# Altium project uC_Board.PrjPcb
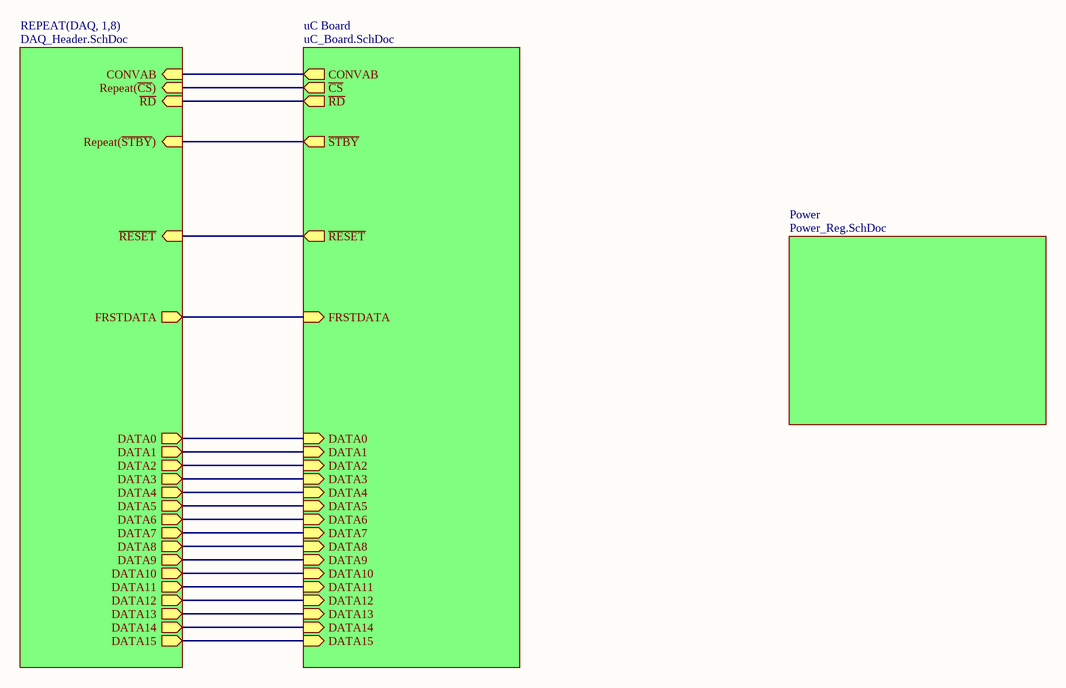
[diagram p0: High_Level_uC_Board.SchDoc]
4 sheets, 75 parts. Net scope: hierarchical (ports join the sheet entries above them; power ports are global).
Board file: FC_MainBoard.PcbDoc
Sheets:
  High_Level_uC_Board.SchDoc
    uC Board = uC_Board.SchDoc
    Power = Power_Reg.SchDoc
    DAQ1 = DAQ_Header.SchDoc
    DAQ2 = DAQ_Header.SchDoc
    DAQ3 = DAQ_Header.SchDoc
    DAQ4 = DAQ_Header.SchDoc
    DAQ5 = DAQ_Header.SchDoc
    DAQ6 = DAQ_Header.SchDoc
    DAQ7 = DAQ_Header.SchDoc
    DAQ8 = DAQ_Header.SchDoc

## Sheet High_Level_uC_Board.SchDoc
size A

### Sub-sheets
Power = Power_Reg.SchDoc: no entries
REPEAT(DAQ, 1,8) = DAQ_Header.SchDoc: CONVAB (in), Repeat(~{CS}) (in), ~{RD} (in), Repeat(~{STBY}) (in), ~{RESET} (in), FRSTDATA (out), DATA0 (out), DATA1 (out), DATA2 (out), DATA3 (out), DATA4 (out), DATA5 (out), DATA6 (out), DATA7 (out), DATA8 (out), DATA9 (out), DATA10 (out), DATA11 (out), DATA12 (out), DATA13 (out), DATA14 (out), DATA15 (out)
uC Board = uC_Board.SchDoc: CONVAB (out), ~{CS} (out), ~{RD} (out), ~{STBY} (out), ~{RESET} (out), FRSTDATA (in), DATA0 (in), DATA1 (in), DATA2 (in), DATA3 (in), DATA4 (in), DATA5 (in), DATA6 (in), DATA7 (in), DATA8 (in), DATA9 (in), DATA10 (in), DATA11 (in), DATA12 (in), DATA13 (in), DATA14 (in), DATA15 (in)

### Nets
~{CS}_DAQ[1..8]: sheet uC Board/~{CS}, sheet REPEAT(DAQ, 1,8)/Repeat(~{CS})
CONVAB: sheet uC Board/CONVAB, sheet REPEAT(DAQ, 1,8)/CONVAB
DATA0: sheet uC Board/DATA0, sheet REPEAT(DAQ, 1,8)/DATA0
DATA1: sheet uC Board/DATA1, sheet REPEAT(DAQ, 1,8)/DATA1
DATA2: sheet uC Board/DATA2, sheet REPEAT(DAQ, 1,8)/DATA2
DATA3: sheet uC Board/DATA3, sheet REPEAT(DAQ, 1,8)/DATA3
DATA4: sheet uC Board/DATA4, sheet REPEAT(DAQ, 1,8)/DATA4
DATA5: sheet uC Board/DATA5, sheet REPEAT(DAQ, 1,8)/DATA5
DATA6: sheet uC Board/DATA6, sheet REPEAT(DAQ, 1,8)/DATA6
DATA7: sheet uC Board/DATA7, sheet REPEAT(DAQ, 1,8)/DATA7
DATA8: sheet uC Board/DATA8, sheet REPEAT(DAQ, 1,8)/DATA8
DATA9: sheet uC Board/DATA9, sheet REPEAT(DAQ, 1,8)/DATA9
DATA10: sheet uC Board/DATA10, sheet REPEAT(DAQ, 1,8)/DATA10
DATA11: sheet uC Board/DATA11, sheet REPEAT(DAQ, 1,8)/DATA11
DATA12: sheet uC Board/DATA12, sheet REPEAT(DAQ, 1,8)/DATA12
DATA13: sheet uC Board/DATA13, sheet REPEAT(DAQ, 1,8)/DATA13
DATA14: sheet uC Board/DATA14, sheet REPEAT(DAQ, 1,8)/DATA14
DATA15: sheet uC Board/DATA15, sheet REPEAT(DAQ, 1,8)/DATA15
FRSTDATA: sheet uC Board/FRSTDATA, sheet REPEAT(DAQ, 1,8)/FRSTDATA
~{RD}: sheet uC Board/~{RD}, sheet REPEAT(DAQ, 1,8)/~{RD}
~{RESET}: sheet uC Board/~{RESET}, sheet REPEAT(DAQ, 1,8)/~{RESET}
(unnamed): sheet uC Board/~{STBY}, sheet REPEAT(DAQ, 1,8)/Repeat(~{STBY})

## Sheet uC_Board.SchDoc
size Legal
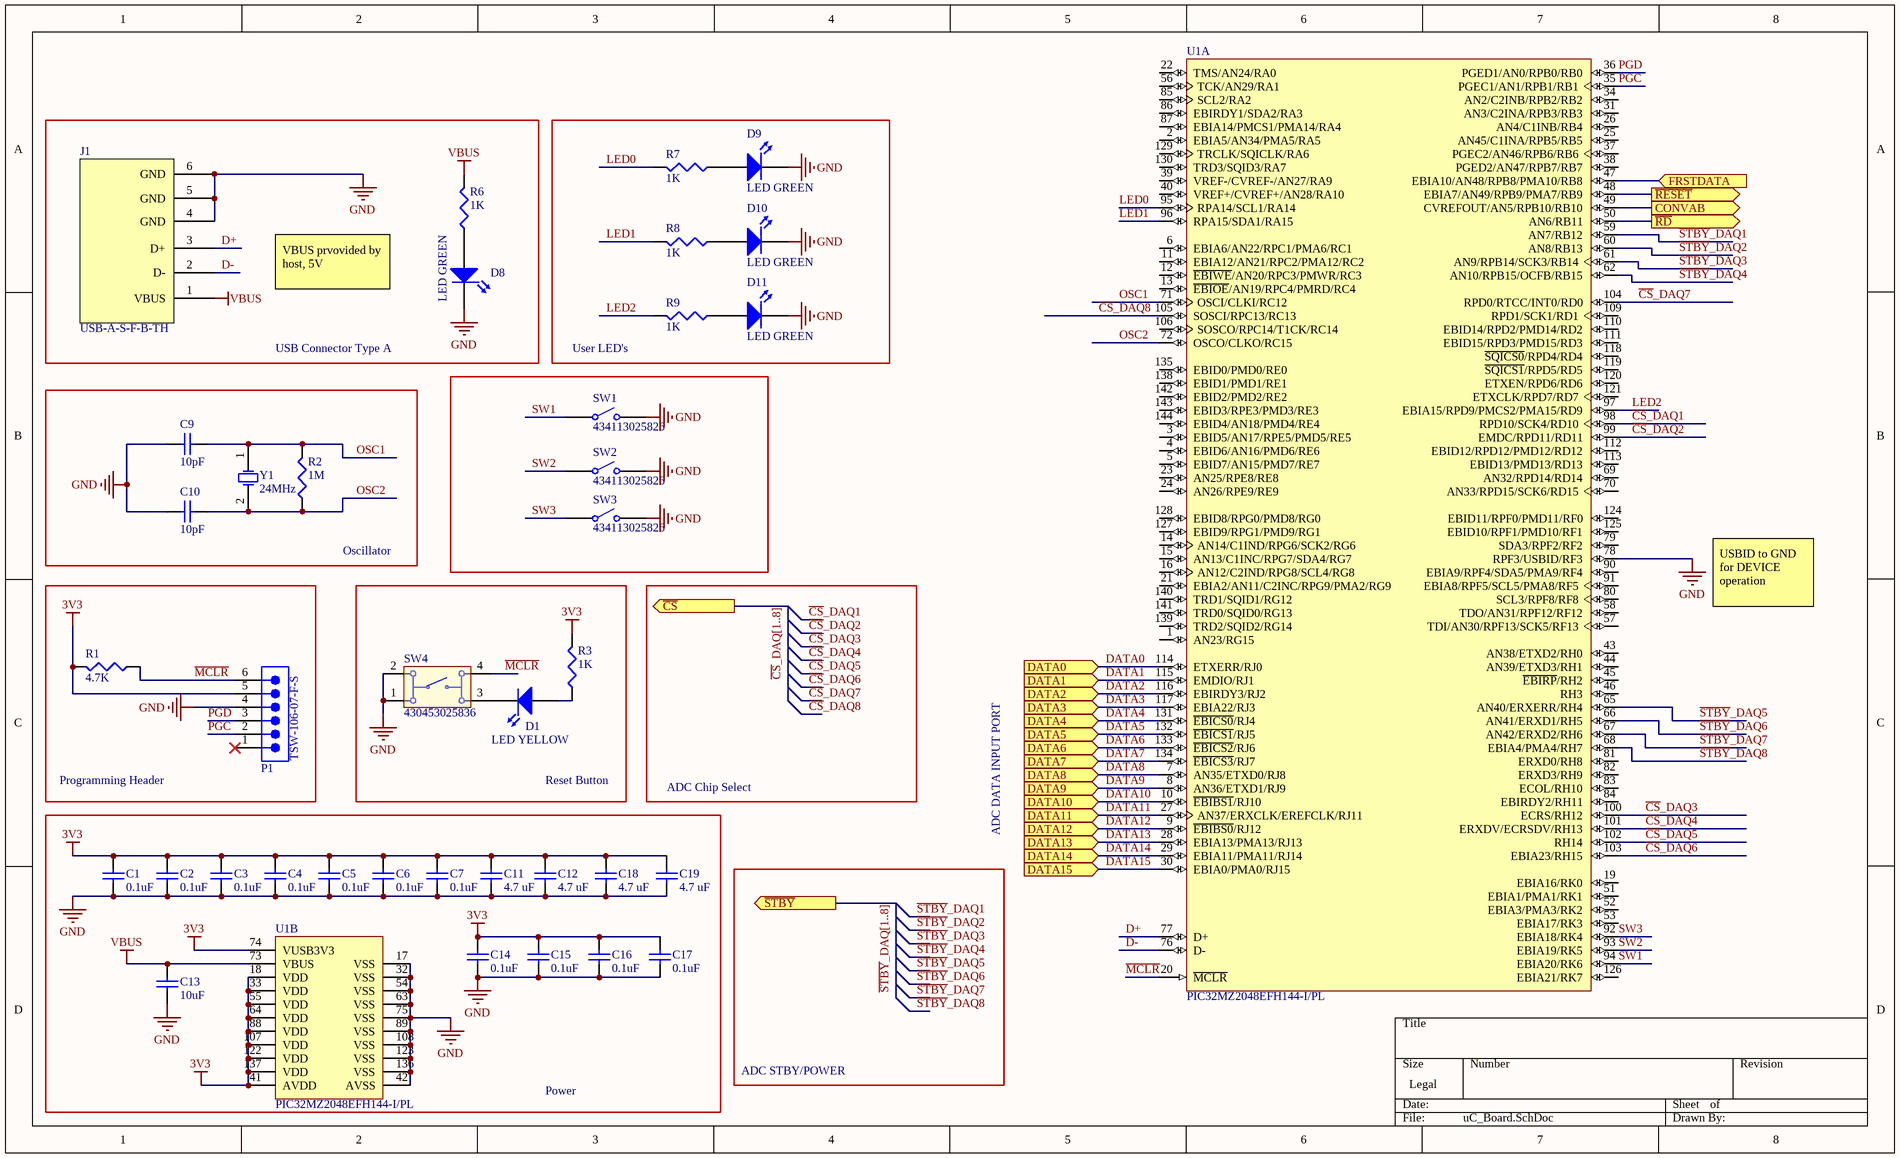
[diagram p1: uC_Board.SchDoc]

### Parts
C1  value 0.1uF  [0402]  (hidden comment: C0402)
C2  value 0.1uF  [0402]  (hidden comment: C0402)
C3  value 0.1uF  [0402]  (hidden comment: C0402)
C4  value 0.1uF  [0402]  (hidden comment: C0402)
C5  value 0.1uF  [0402]  (hidden comment: C0402)
C6  value 0.1uF  [0402]  (hidden comment: C0402)
C7  value 0.1uF  [0402]  (hidden comment: C0402)
C9  value 10pF  [0805]  (hidden comment: C0805)
C10  value 10pF  [0805]  (hidden comment: C0805)
C11  value 4.7 uF  [0603]  (hidden comment: C0603)
C12  value 4.7 uF  [0603]  (hidden comment: C0603)
C13  value 10uF  [0805]  (hidden comment: C0805)
C14  value 0.1uF  [0402]  (hidden comment: C0402)
C15  value 0.1uF  [0402]  (hidden comment: C0402)
C16  value 0.1uF  [0402]  (hidden comment: C0402)
C17  value 0.1uF  [0402]  (hidden comment: C0402)
C18  value 4.7 uF  [0603]  (hidden comment: C0603)
C19  value 4.7 uF  [0603]  (hidden comment: C0603)
D1  LED YELLOW  [C0805]
D8  LED GREEN  [C0805]
D9  LED GREEN  [C0805]
D10  LED GREEN  [C0805]
D11  LED GREEN  [C0805]
J1  USB-A-S-F-B-TH  [USB-A Connector]
P1  TSW-106-07-F-S  [SMTC-TSW-106-07-X-S]
R1  value 4.7K  [J1-0603]  (hidden comment: Res3)
R2  value 1M  [0402]  (hidden comment: Res3)
R3  value 1K  [0402]  (hidden comment: Res3)
R6  value 1K  [0402]  (hidden comment: Res3)
R7  value 1K  [0402]  (hidden comment: Res3)
R8  value 1K  [0402]  (hidden comment: Res3)
R9  value 1K  [0402]  (hidden comment: Res3)
SW1  434113025826  [434113025826]
SW2  434113025826  [434113025826]
SW3  434113025826  [434113025826]
SW4  430453025836  [430453025836]
U1  PIC32MZ2048EFH144-I/PL  [MCHP-LQFP-PL144_N]  (parts A,B of 2)
Y1  24MHz  [HC49US]

### Blocks framed on the sheet
USB Connector Type A: D8 J1 R6
User LED's: D9-D11 R7-R9
Oscillator: C9 C10 R2 Y1
Programming Header: P1 R1
Reset Button: D1 R3 SW4
Power: C1-C7 C11-C19 U1

### Ports
CONVAB (out), DATA0 (in), DATA1 (in), DATA2 (in), DATA3 (in), DATA4 (in), DATA5 (in), DATA6 (in), DATA7 (in), DATA8 (in), DATA9 (in), DATA10 (in), DATA11 (in), DATA12 (in), DATA13 (in), DATA14 (in), DATA15 (in), FRSTDATA (in), ~{CS} (out), ~{RD} (out), ~{RESET} (out), ~{STBY} (out)

### Nets
3V3: C1.2 C2.2 C3.2 C4.2 C5.2 C6.2 C7.2 C11.1 C12.1 C14.2 C15.2 C16.2 C17.2 C18.1 C19.1 P1.5 R1.2 R3.2 U1.18(VDD) U1.33(VDD) U1.41(AVDD) U1.55(VDD) U1.64(VDD) U1.74(VUSB3V3) U1.88(VDD) U1.107(VDD) U1.122(VDD) U1.137(VDD)
GND: C1.1 C2.1 C3.1 C4.1 C5.1 C6.1 C7.1 C9.1 C10.1 C11.2 C12.2 C13.1 C14.1 C15.1 C16.1 C17.1 C18.2 C19.2 D8.2(K) D9.2(K) D10.2(K) D11.2(K) J1.4(GND) J1.5(GND) J1.6(GND) P1.4 SW1.2 SW2.2 SW3.2 SW4.1 SW4.2 U1.17(VSS) U1.32(VSS) U1.42(AVSS) U1.54(VSS) U1.63(VSS) U1.75(VSS) U1.78(RPF3/USBID/RF3) U1.89(VSS) U1.108(VSS) U1.123(VSS) U1.136(VSS)
VBUS: C13.2 J1.1(VBUS) R6.2 U1.73(VBUS)
~{CS}_DAQ1: U1.98(RPD10/SCK4/RD10)
~{CS}_DAQ2: U1.99(EMDC/RPD11/RD11)
~{CS}_DAQ3: U1.100(ECRS/RH12)
~{CS}_DAQ4: U1.101(ERXDV/ECRSDV/RH13)
~{CS}_DAQ5: U1.102(RH14)
~{CS}_DAQ6: U1.103(EBIA23/RH15)
~{CS}_DAQ7: U1.104(RPD0/RTCC/INT0/RD0)
~{CS}_DAQ8: U1.105(SOSCI/RPC13/RC13)
CONVAB: U1.49(CVREFOUT/AN5/RPB10/RB10) ; port CONVAB
D+: J1.3(D+) U1.77(D+)
D-: J1.2(D-) U1.76(D-)
DATA0: U1.114(ETXERR/RJ0) ; port DATA0
DATA1: U1.115(EMDIO/RJ1) ; port DATA1
DATA2: U1.116(EBIRDY3/RJ2) ; port DATA2
DATA3: U1.117(EBIA22/RJ3) ; port DATA3
DATA4: U1.131(~{EBICS0}/RJ4) ; port DATA4
DATA5: U1.132(~{EBICS1}/RJ5) ; port DATA5
DATA6: U1.133(~{EBICS2}/RJ6) ; port DATA6
DATA7: U1.134(~{EBICS3}/RJ7) ; port DATA7
DATA8: U1.7(AN35/ETXD0/RJ8) ; port DATA8
DATA9: U1.8(AN36/ETXD1/RJ9) ; port DATA9
DATA10: U1.10(~{EBIBS1}/RJ10) ; port DATA10
DATA11: U1.27(AN37/ERXCLK/EREFCLK/RJ11) ; port DATA11
DATA12: U1.9(~{EBIBS0}/RJ12) ; port DATA12
DATA13: U1.28(EBIA13/PMA13/RJ13) ; port DATA13
DATA14: U1.29(EBIA11/PMA11/RJ14) ; port DATA14
DATA15: U1.30(EBIA0/PMA0/RJ15) ; port DATA15
FRSTDATA: U1.47(EBIA10/AN48/RPB8/PMA10/RB8) ; port FRSTDATA
LED0: R7.2 U1.95(RPA14/SCL1/RA14)
LED1: R8.2 U1.96(RPA15/SDA1/RA15)
LED2: R9.2 U1.97(EBIA15/RPD9/PMCS2/PMA15/RD9)
~{MCLR}: P1.6 R1.1 SW4.4 U1.20(~{MCLR})
OSC1: C9.2 R2.2 U1.71(OSCI/CLKI/RC12) Y1.1(OSC1)
OSC2: C10.2 R2.1 U1.72(OSCO/CLKO/RC15) Y1.2(OSC2)
PGC: P1.2 U1.35(PGEC1/AN1/RPB1/RB1)
PGD: P1.3 U1.36(PGED1/AN0/RPB0/RB0)
~{RD}: U1.50(AN6/RB11) ; port ~{RD}
~{RESET}: U1.48(EBIA7/AN49/RPB9/PMA7/RB9) ; port ~{RESET}
~{STBY}_DAQ1: U1.59(AN7/RB12)
~{STBY}_DAQ2: U1.60(AN8/RB13)
~{STBY}_DAQ3: U1.61(AN9/RPB14/SCK3/RB14)
~{STBY}_DAQ4: U1.62(AN10/RPB15/OCFB/RB15)
~{STBY}_DAQ5: U1.65(AN40/ERXERR/RH4)
~{STBY}_DAQ6: U1.66(AN41/ERXD1/RH5)
~{STBY}_DAQ7: U1.67(AN42/ERXD2/RH6)
~{STBY}_DAQ8: U1.68(EBIA4/PMA4/RH7)
SW1: SW1.1 U1.94(EBIA20/RK6)
SW2: SW2.1 U1.93(EBIA19/RK5)
SW3: SW3.1 U1.92(EBIA18/RK4)
NetD1_1: D1.1(A) R3.1
NetD1_2: D1.2(K) SW4.3
NetD8_1: D8.1(A) R6.1
NetD9_1: D9.1(A) R7.1
NetD10_1: D10.1(A) R8.1
NetD11_1: D11.1(A) R9.1

Not connected (* = marked no-connect by the designer): P1 1*; U1 1(AN23/RG15) 2(EBIA5/AN34/PMA5/RA5) 3(EBID5/AN17/RPE5/PMD5/RE5) 4(EBID6/AN16/PMD6/RE6) 5(EBID7/AN15/PMD7/RE7) 6(EBIA6/AN22/RPC1/PMA6/RC1) 11(EBIA12/AN21/RPC2/PMA12/RC2) 12(~{EBIWE}/AN20/RPC3/PMWR/RC3) 13(~{EBIOE}/AN19/RPC4/PMRD/RC4) 14(AN14/C1IND/RPG6/SCK2/RG6) 15(AN13/C1INC/RPG7/SDA4/RG7) 16(AN12/C2IND/RPG8/SCL4/RG8) 19(EBIA16/RK0) 21(EBIA2/AN11/C2INC/RPG9/PMA2/RG9) 22(TMS/AN24/RA0) 23(AN25/RPE8/RE8) 24(AN26/RPE9/RE9) 25(AN45/C1INA/RPB5/RB5) 26(AN4/C1INB/RB4) 31(AN3/C2INA/RPB3/RB3) 34(AN2/C2INB/RPB2/RB2) 37(PGEC2/AN46/RPB6/RB6) 38(PGED2/AN47/RPB7/RB7) 39(VREF-/CVREF-/AN27/RA9) 40(VREF+/CVREF+/AN28/RA10) 43(AN38/ETXD2/RH0) 44(AN39/ETXD3/RH1) 45(~{EBIRP}/RH2) 46(RH3) 51(EBIA1/PMA1/RK1) 52(EBIA3/PMA3/RK2) 53(EBIA17/RK3) 56(TCK/AN29/RA1) 57(TDI/AN30/RPF13/SCK5/RF13) 58(TDO/AN31/RPF12/RF12) 69(AN32/RPD14/RD14) 70(AN33/RPD15/SCK6/RD15) 79(SDA3/RPF2/RF2) 80(SCL3/RPF8/RF8) 81(ERXD0/RH8) 82(ERXD3/RH9) 83(ECOL/RH10) 84(EBIRDY2/RH11) 85(SCL2/RA2) 86(EBIRDY1/SDA2/RA3) 87(EBIA14/PMCS1/PMA14/RA4) 90(EBIA9/RPF4/SDA5/PMA9/RF4) 91(EBIA8/RPF5/SCL5/PMA8/RF5) 106(SOSCO/RPC14/T1CK/RC14) 109(RPD1/SCK1/RD1) 110(EBID14/RPD2/PMD14/RD2) 111(EBID15/RPD3/PMD15/RD3) 112(EBID12/RPD12/PMD12/RD12) 113(EBID13/PMD13/RD13) 118(~{SQICS0}/RPD4/RD4) 119(~{SQICS1}/RPD5/RD5) 120(ETXEN/RPD6/RD6) 121(ETXCLK/RPD7/RD7) 124(EBID11/RPF0/PMD11/RF0) 125(EBID10/RPF1/PMD10/RF1) 126(EBIA21/RK7) 127(EBID9/RPG1/PMD9/RG1) 128(EBID8/RPG0/PMD8/RG0) 129(TRCLK/SQICLK/RA6) 130(TRD3/SQID3/RA7) 135(EBID0/PMD0/RE0) 138(EBID1/PMD1/RE1) 139(TRD2/SQID2/RG14) 140(TRD1/SQID1/RG12) 141(TRD0/SQID0/RG13) 142(EBID2/PMD2/RE2) 143(EBID3/RPE3/PMD3/RE3) 144(EBID4/AN18/PMD4/RE4)

### Buses and harness runs
bus ~{STBY}_DAQ[1..8]

### Notes on the sheet
- VBUS prvovided by host, 5V
- USBID to GND for DEVICE operation
- ADC Chip Select
- ADC DATA INPUT PORT
- ADC STBY/POWER

### Library data of the parts
C1-C7 C14-C17 = C0402: Ceramic Chip Capacitor - Standard; Note: Footprint corresponds to dimensions for bulk cassette packaging. This case size has tightened tolerances.; Published: 17-Jul-2002; LatestRevisionDate: 19-Mar-2004; LatestRevisionNote: Silkscreen size reduced.; DatasheetDocument: Mar-2001; PackageDocument: Mar-2001; PackageReference: 0402; Publisher: Altium Limited; Code_JEITA: 0402; Code_IPC: 1005 [0402]; ComponentLink1Description: Manufacturer Link; ComponentLink1URL: http://www.kemet.com/; ComponentLink2Description: Datasheet; ComponentLink2URL: http://www.kemet.com/kemet/web/homepage/kechome.nsf/vapubfilesname/F3102TA.pdf/$file/F3102TA.pdf; Supplier Part Number 1: 399-7332-1-ND; Supplier 1: Digikey
C9 C10 C13 = C0805: Ceramic Chip Capacitor - Standard; Note: Footprint corresponds to dimensions for bulk cassette packaging. This case size has tightened tolerances.; Published: 17-Jul-2002; LatestRevisionDate: 19-Mar-2004; LatestRevisionNote: Silkscreen size reduced.; DatasheetDocument: Mar-2001; PackageDocument: Mar-2001; PackageReference: 0805; Publisher: Altium Limited; Code_JEITA: 0805; Code_IPC: 2012[0805]; ComponentLink1Description: Manufacturer Link; ComponentLink1URL: http://www.kemet.com/; ComponentLink2Description: Datasheet; ComponentLink2URL: http://www.kemet.com/kemet/web/homepage/kechome.nsf/vapubfilesname/F3102TA.pdf/$file/F3102TA.pdf; Supplier 1: Digikey
  C9 C10: Supplier Part Number 1: 399-9987-1-ND
  C13: Supplier Part Number 1: 490-6473-1-ND
C11 C12 C18 C19 = C0603: Ceramic Chip Capacitor - Standard; Note: Footprint corresponds to dimensions for bulk cassette packaging. This case size has tightened tolerances.; Published: 17-Jul-2002; LatestRevisionDate: 19-Mar-2004; LatestRevisionNote: Silkscreen size reduced.; DatasheetDocument: Mar-2001; PackageDocument: Mar-2001; PackageReference: 0603; Publisher: Altium Limited; Code_JEITA: 0603; Code_IPC: 1608 [0603]; ComponentLink1Description: Manufacturer Link; ComponentLink1URL: http://www.kemet.com/; ComponentLink2Description: Datasheet; ComponentLink2URL: http://www.kemet.com/kemet/web/homepage/kechome.nsf/vapubfilesname/F3102TA.pdf/$file/F3102TA.pdf; Supplier Part Number 1: 445-7478-1-ND; Supplier 1: Digikey
D1 = LED_YELLOW: Red LED; SMD 0805; Supplier 1: Digikey; Supplier Part Number 1: 67-1558-1-ND
D8-D11 = LED_GREEN: Green LED; SMD 0805; Supplier Part Number 1: 67-1557-1-ND; Supplier 1: Digikey
J1 = USB-A Connector: USB-A Connector- Through Hole; Supplier 1: Samtec; Supplier Part Number 1: USB-A-S-F-B-TH
P1 = TSW-106-07-F-S: 0.025" SQ Post Header, Through-hole, Vertical, -55 to 125 degC, 2.54 mm Pitch, 6-Pin, Male, RoHS; Manufacturer: Samtec; Pitch: 2.54 mm; DatasheetVersion: F-214; PackageVersion: DM, 8/1988; PackageReference: TSW-106-07-X-S; PackageDescription: .025[0.64] SQ. Post Terminal Strip Assembly; Supplier 1: Digi-Key; Supplier Part Number 1: TSW-106-07-F-S-ND; Orientation: Vertical; RoHS: True; Temperature Range: -55 to 125 degC; Mounting Technology: Through-hole; PartNumber: TSW-106-07-F-S; ComponentLink1Description: Manufacturer URL; ComponentLink1URL: http://www.samtec.com; ComponentLink2Description: Datasheet; ComponentLink2URL: http://www.samtec.com/documents/webfiles/pdf/TSW_TH.PDF; ComponentLink3Description: Package Specification; ComponentLink3URL: http://www.samtec.com/documents/webfiles/cpdf/TSW-XXX-XX-XXX-X-XX-XXX-MKT.pdf
R1-R3 R6-R9 = Res3: Resistor; Published: 8-Jun-2000; LatestRevisionDate: 29-May-2009; LatestRevisionNote: IPC-7351 Footprint Added.; PackageReference: J1-0603; Publisher: Altium Limited; PackageDescription: Chip Resistor; Supplier: Digikey
  R1: Supplier Part Number 1: 311-4.7KGRCT-ND
  R2: Supplier Part Number 1: 541-1.0MAVCT-ND
  R3 R6-R9: Supplier Part Number 1: 311-1.00KLRCT-ND
SW1-SW3 = 434113025826: WS-TASV J-Bend SMD Tact Switch 6.0X3.8 mm; NoPins: 02; PackageReference: 434113025826; PartNumber: 434113025826; ComponentLink1Description: Manufacturer URL; ComponentLink1URL: http://www.we-online.com; ComponentLink2Description: Datasheet; ComponentLink2URL: http://katalog.we-online.de/em/datasheet/434113025826.pdf; Supplier 1: Digikey; Supplier Part Number 1: 732-7042-1-ND
SW4 = 430453025836: WS-TASV J-Bend SMD Tact Switch 6X6 mm; NoPins: 04; PackageReference: 430453025836; Supplier Part Number 1: 732-7013-1-ND; ComponentLink1Description: Manufacturer URL; ComponentLink1URL: http://www.we-online.com; ComponentLink2Description: Datasheet; ComponentLink2URL: http://katalog.we-online.de/em/datasheet/4304x3.pdf; Supplier 1: Digikey
U1 = PIC32MZ2048ECH144-I/PL: 32-Bit Microcontroller with Audio and Graphics Interfaces, HS USB, Ethernet, and Advanced Analog, 2048 KB Program Memory, 120 I/O Pins, PMP, Industrial Temperature, 144-Pin LQFP (PL144), Tray; Manufacturer: Microchip; VCC Range: 2.2 to 3.6 V; DatasheetVersion: Rev. B; PackageVersion: C04-044B, 12/2012; PackageReference: LQFP-PL144; PackageDescription: 144-Lead Plastic Low Profile Quad Flatpack, 20 x 20 mm Body, 0.5 mm Pitch; Supplier 1: Digi-Key; Supplier Part Number 1: PIC32MZ2048ECH144-I/PL-ND; Supplier 2: Newark; Supplier Part Number 2: 17X9365; Supplier 3: Mouser; Supplier Part Number 3: 579-2048ECH144-I/PL; Packing: Tray; Mounting Technology: Surface Mount; PartNumber: PIC32MZ2048EFH144-I/PL; ComponentLink1Description: Manufacturer URL; ComponentLink1URL: http://www.microchip.com/; ComponentLink2Description: Datasheet; ComponentLink2URL: http://ww1.microchip.com/downloads/en/DeviceDoc/60001191B.pdf; ComponentLink3Description: Package Specification; ComponentLink3URL: http://www.microchip.com/stellent/groups/techpub_sg/documents/packagingspec/en012702.pdf
Y1 = XTAL: Crystal Oscillator; Published: 8-Jun-2000; LatestRevisionDate: 17-Jul-2002; LatestRevisionNote: Re-released for DXP Platform.; PackageReference: HC49US; Publisher: Altium Limited; PackageDescription: Crystal; SMD HC49US; Supplier Part Number 1: 300-6145-1-ND; Supplier 1: Digikey

## Sheet Power_Reg.SchDoc
size A4
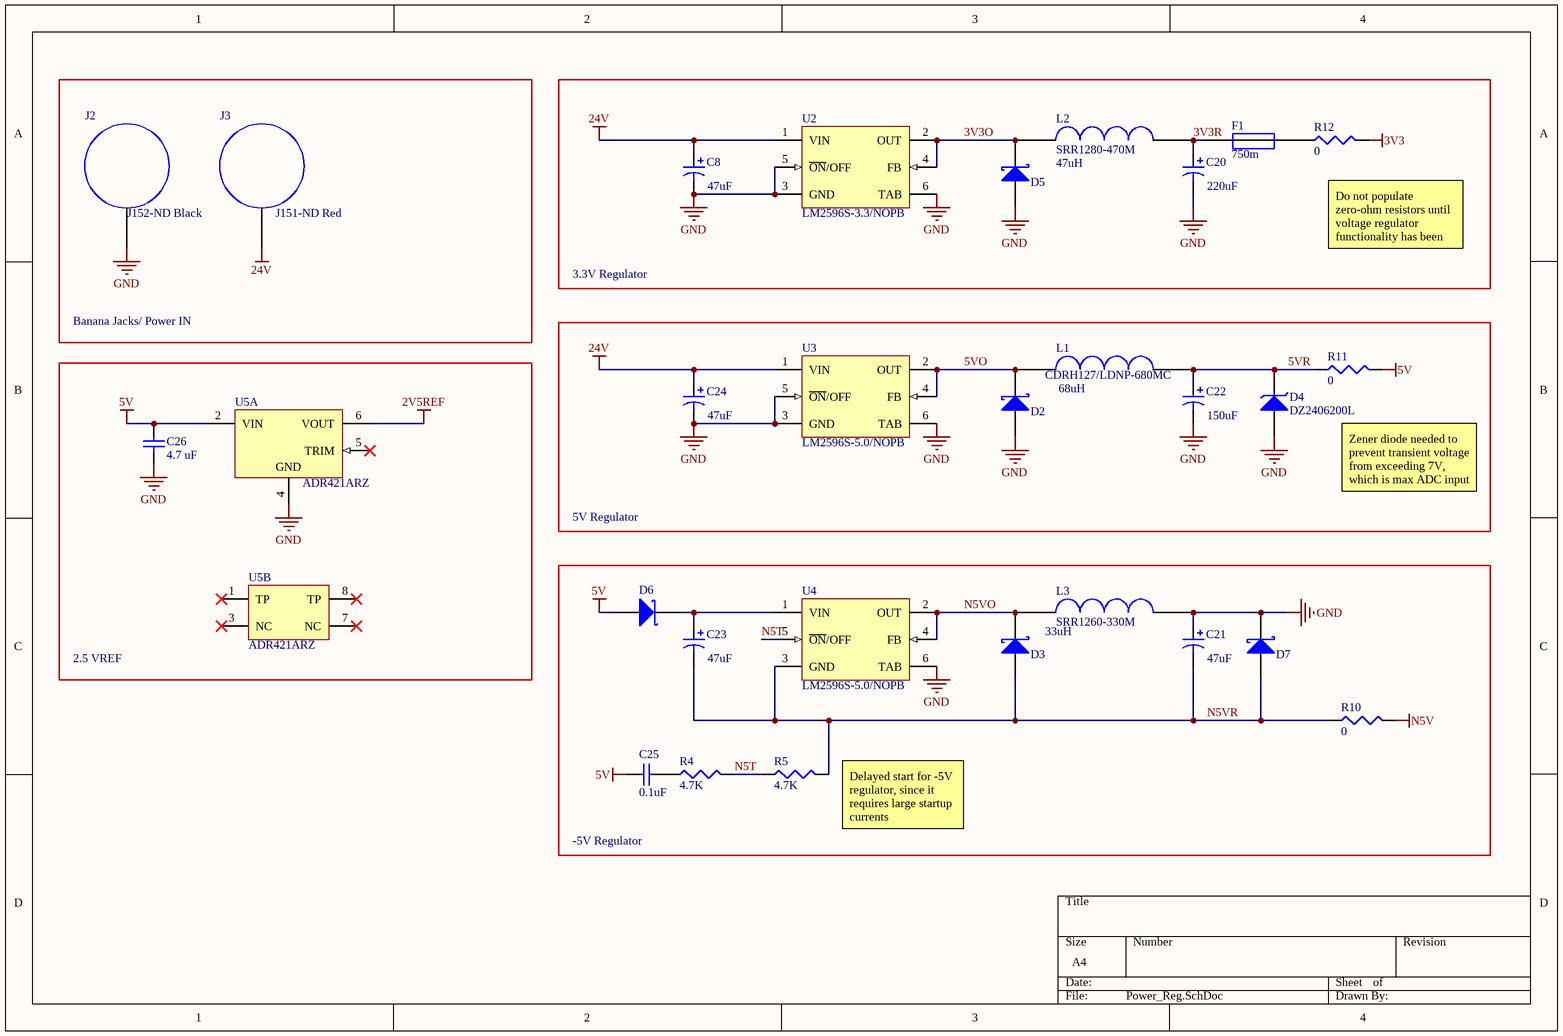
[diagram p2: Power_Reg.SchDoc]

### Parts
C8  value 47uF  [7343]  (hidden comment: 399-3905-2-ND)
C20  value 220uF  [7343]  (hidden comment: 399-10429-1-ND)
C21  value 47uF  [7343]  (hidden comment: 399-3905-2-ND)
C22  value 150uF  [7343]  (hidden comment: 399-3778-1-ND)
C23  value 47uF  [7343]  (hidden comment: 399-3905-2-ND)
C24  value 47uF  [7343]  (hidden comment: 399-3905-2-ND)
C25  value 0.1uF  [0402]  (hidden comment: C0402)
C26  value 4.7 uF  [0603]  (hidden comment: C0603)
D2  PMEG4050EP,115  [PMEG4050EP,115]  (value not drawn)
D3  PMEG4050EP,115  [PMEG4050EP,115]  (value not drawn)
D4  DZ2406200L  [DZ2406200L]
D5  PMEG4050EP,115  [PMEG4050EP,115]  (value not drawn)
D6  RSX501L-20TE25  [RSX501L-20TE25]  (value not drawn)
D7  PMEG4050EP,115  [PMEG4050EP,115]  (value not drawn)
F1  value 750m  [1206]  (hidden comment: TR/3216FF750-R)
J2  J152-ND Black  [Banana Jack]
J3  J151-ND Red  [Banana Jack]
L1  CDRH127/LDNP-680MC  value 68uH  [CDRH127/LDNP-680MC]
L2  SRR1280-470M  value 47uH  [SRR1280-470M]
L3  SRR1260-330M  value 33uH  [SRR1260-330M]
R4  value 4.7K  [J1-0603]  (hidden comment: Res3)
R5  value 4.7K  [J1-0603]  (hidden comment: Res3)
R10  value 0  [0805]  (hidden comment: 5106)
R11  value 0  [0805]  (hidden comment: 5106)
R12  value 0  [0805]  (hidden comment: 5106)
U2  LM2596S-3.3/NOPB  [TS5B_M]
U3  LM2596S-5.0/NOPB  [TS5B_M]
U4  LM2596S-5.0/NOPB  [TS5B_N]
U5  ADR421ARZ  [ADI-R-8_N]  (parts A,B of 2)

### Blocks framed on the sheet
Banana Jacks/ Power IN: J2 J3
3.3V Regulator: C8 C20 D5 F1 L2 R12 U2
5V Regulator: C22 C24 D2 D4 L1 R11 U3
2.5 VREF: C26 U5
-5V Regulator: C21 C23 C25 D3 D6 D7 L3 R4 R5 R10 U4

### Nets
2V5REF: U5.6(VOUT)
3V3: R12.2
5V: C25.2 C26.1 D6.1(A) R11.2 U5.2(VIN)
24V: C8.1 C24.1 J3.1 U2.1(VIN) U3.1(VIN)
GND: C8.2 C20.2 C21.1 C22.2 C24.2 C26.2 D2.1(A) D4.1(A) D5.1(A) D7.2(K) J2.1 L3.2 U2.3(GND) U2.5(~{ON}/OFF) U2.6(TAB) U3.3(GND) U3.5(~{ON}/OFF) U3.6(TAB) U4.6(TAB) U5.4(GND)
N5V: R10.2
3V3O: D5.2(K) L2.1 U2.2(OUT) U2.4(FB)
3V3R: C20.1 F1.1 L2.2
5VO: D2.2(K) L1.1 U3.2(OUT) U3.4(FB)
5VR: C22.1 D4.2(K) L1.2 R11.1
N5T: R4.2 R5.1 U4.5(~{ON}/OFF)
N5VO: D3.2(K) L3.1 U4.2(OUT) U4.4(FB)
N5VR: C21.2 C23.2 D3.1(A) D7.1(A) R5.2 R10.1 U4.3(GND)
NetC23_1: C23.1 D6.2(K) U4.1(VIN)
NetC25_1: C25.1 R4.1
NetF1_2: F1.2 R12.1

Not connected (* = marked no-connect by the designer): U5 1(TP)* 3(NC)* 5(TRIM)* 7(NC)* 8(TP)*

### Notes on the sheet
- (near R12) Do not populate zero-ohm resistors until voltage regulator functionality has been verified
- Zener diode needed to prevent transient voltage from exceeding 7V, which is max ADC input voltage
- (near R5) Delayed start for -5V regulator, since it requires large startup currents

### Library data of the parts
C8 C21 C23 C24 = CWR11DH476M: CAP TANT 47UF 35V 10% 2917; Note: See Data Sheet for full range of components; Published: 19-Mar-2004; DatasheetDocument: 20-Mar-2003; PackageReference: 7343; Publisher: Altium Limited; Code_JEITA: 7343; ComponentLink1Description: Manufacturer Link; ComponentLink1URL: http://www.vishay.com/; ComponentLink2Description: Datasheet; Supplier Part Number 1: 399-3905-1-ND; Supplier: Digikey
C20 = CWR11DH476M: CAP TANT 220uF 16V 10% 2917; Note: See Data Sheet for full range of components; Published: 19-Mar-2004; DatasheetDocument: 20-Mar-2003; PackageReference: 7343; Publisher: Altium Limited; Code_JEITA: 7343; ComponentLink1Description: Manufacturer Link; ComponentLink1URL: http://www.vishay.com/; ComponentLink2Description: Datasheet; Supplier Part Number 1: 399-10429-1-ND; Supplier: Digikey
C22 = CWR11DH476M: CAP TANT 150UF 10V 10% 2917; Note: See Data Sheet for full range of components; Published: 19-Mar-2004; DatasheetDocument: 20-Mar-2003; PackageReference: 7343; Publisher: Altium Limited; Code_JEITA: 7343; ComponentLink1Description: Manufacturer Link; ComponentLink1URL: http://www.vishay.com/; ComponentLink2Description: Datasheet; Supplier Part Number 1: 399-3778-1-ND; Supplier: Digikey
C25 = C0402: as C1 on sheet uC_Board; Published: 17-Jul-2002; LatestRevisionDate: 19-Mar-2004; LatestRevisionNote: Silkscreen size reduced.; DatasheetDocument: Mar-2001; PackageDocument: Mar-2001; PackageReference: 0402; Publisher: Altium Limited; Code_JEITA: 0402; Code_IPC: 1005 [0402]; ComponentLink1Description: Manufacturer Link; ComponentLink1URL: http://www.kemet.com/; ComponentLink2Description: Datasheet; ComponentLink2URL: http://www.kemet.com/kemet/web/homepage/kechome.nsf/vapubfilesname/F3102TA.pdf/$file/F3102TA.pdf; Supplier Part Number 1: 1276-1443-1-ND; Supplier 1: Digikey
C26 = C0603: as C11 on sheet uC_Board; Published: 17-Jul-2002; LatestRevisionDate: 19-Mar-2004; LatestRevisionNote: Silkscreen size reduced.; DatasheetDocument: Mar-2001; PackageDocument: Mar-2001; PackageReference: 0603; Publisher: Altium Limited; Code_JEITA: 0603; Code_IPC: 1608 [0603]; ComponentLink1Description: Manufacturer Link; ComponentLink1URL: http://www.kemet.com/; ComponentLink2Description: Datasheet; ComponentLink2URL: http://www.kemet.com/kemet/web/homepage/kechome.nsf/vapubfilesname/F3102TA.pdf/$file/F3102TA.pdf; Supplier Part Number 1: 445-7478-1-ND; Supplier 1: Digikey
D2 D3 D5 D7 = PMEG4050EP,115: Schottky Diode, 5A, 40V, SOD-128 Package; Supplier 1: Digikey; Supplier Part Number 1: 568-7408-1-ND
D4 = DZ2406200L: DIODE ZENER 6.2V 2W TMINIP2. SOD-128; Supplier 1: Digikey; Supplier Part Number 1: DZ2406200LCT-ND
D6 = RSX501L-20TE25: DIODE SCHOTTKY 20V 5A PMDS; Supplier 1: Digikey; Supplier Part Number 1: RSX501L-20TE25CT-ND
F1 = SF-0402F075-2: FUSE BOARD MNT 750MA 32VAC 63VDC; Supplier 1: Digikey; Supplier Part Number 1: 283-2540-1-ND
J2 = J-152-ND - Black: CONN JACK BANANA INSUL NYLON BLA; Supplier Part Number 1: J152-ND; Supplier 1: Digikey
J3 = J151-ND Red: CONN JACK BANANA INSUL NYLON RED; Supplier Part Number 1: J151-ND; Supplier 1: Digikey
L1 = CDRH127/LDNP-680MC: Non-standard package, shielded inductor, 68uH, 2.5A; Supplier 1: Digikey; Supplier Part Number 1: 308-1341-1-ND
L2 = SRR1280-470M: Non-standard, shielded, 47uH inductor; Supplier 1: Digikey; Supplier Part Number 1: SRR1280-470MCT-ND
L3 = SRR1260-330M: Non-standard, shielded, inductor, 33uH; Supplier Part Number 1: SRR1260-330M; Supplier 1: Digikey
R4 R5 = Res3: Resistor; Published: 8-Jun-2000; LatestRevisionDate: 29-May-2009; LatestRevisionNote: IPC-7351 Footprint Added.; PackageReference: J1-0603; Publisher: Altium Limited; PackageDescription: Chip Resistor; Supplier Part Number 1: 311-4.7KGRCT-ND; Supplier: Digikey
R10-R12 = Res3: RES SMD 0.0 OHM JUMPER 1/2W 0805; Published: 8-Jun-2000; LatestRevisionDate: 29-May-2009; LatestRevisionNote: IPC-7351 Footprint Added.; PackageReference: J1-0603; Publisher: Altium Limited; PackageDescription: Chip Resistor; Supplier 1: Digikey; Supplier Part Number 1: 36-5106CT-ND
U2 = LM2596S-3.3/NOPB: SIMPLE SWITCHER® Power Converter 150 KHz 3A Step-Down Voltage Regulator, 5-pin TO-263, Pb-Free; Manufacturer: National Semiconductor; PackageTopMarking: NSUZXYTTE#*LM2596S*-3.3 P+; PowerWise: N; High-Reliability: Y; DatasheetVersion: May-2002; PackageVersion: revD, Apr-2005; PackageReference: TS5B; PackageDescription: TO-263, Molded, .400 x .390 x .180in, 5 Lead, .067in Pitch, Surface Mount; PartNumber: LM2596S-3.3/NOPB; RoHS: Y; PinCount: 5; CompType: Switcher; Code_JEDEC: MO-169-AB; ComponentLink1Description: Manufacturer URL; ComponentLink1URL: http://www.national.com/; ComponentLink2Description: LM2596 Datasheet; ComponentLink2URL: http://www.national.com/ds/LM/LM2596.pdf; ComponentLink3Description: LM2596 Web Page; ComponentLink3URL: http://www.national.com/pf/LM/LM2596.html; ComponentLink4Description: TS5B Package Page; ComponentLink4URL: http://www.national.com/packaging/folders/ts5b.html
U3 U4 = LM2596S-5.0/NOPB: SIMPLE SWITCHER® Power Converter 150 KHz 3A Step-Down Voltage Regulator, 5-pin TO-263, Pb-Free; Manufacturer: National Semiconductor; PackageTopMarking: NSUZXYTTE#*LM2596S*-5.0 P+; PowerWise: N; High-Reliability: Y; DatasheetVersion: May-2002; PackageVersion: revD, Apr-2005; PackageReference: TS5B; PackageDescription: TO-263, Molded, .400 x .390 x .180in, 5 Lead, .067in Pitch, Surface Mount; PartNumber: LM2596S-5.0/NOPB; RoHS: Y; PinCount: 5; CompType: Switcher; Code_JEDEC: MO-169-AB; ComponentLink1Description: Manufacturer URL; ComponentLink1URL: http://www.national.com/; ComponentLink2Description: LM2596 Datasheet; ComponentLink2URL: http://www.national.com/ds/LM/LM2596.pdf; ComponentLink3Description: LM2596 Web Page; ComponentLink3URL: http://www.national.com/pf/LM/LM2596.html; ComponentLink4Description: TS5B Package Page; ComponentLink4URL: http://www.national.com/packaging/folders/ts5b.html
U5 = ADR421ARZ: Ultraprecision, Low Noise, XFET(R) Voltage Reference, 2.5 V Output, 4.5 to 18 V Supply, Industrial, 8-pin SOIC (R-8), Tube; Manufacturer: Analog Devices; Max V Supply (V): 18; Min V Supply (V): 4.5; Ref Out TC (ppm/C): 2; Vout: 2.5V; DatasheetVersion: Rev. I; PackageVersion: 060506-A, 06/2006; PackageReference: R-8; PackageDescription: 8-Pin Standard Small Outline Package, Body 4.9 x 3.9 mm, Pitch 1.27 mm; Supplier 1: Digi-Key; Supplier Part Number 1: ADR421ARZ-ND; Supplier 2: Farnell; Supplier Part Number 2: 9426094; Supplier 3: Mouser; Supplier Part Number 3: 584-ADR421ARZ; Packing: Tube; Operating Temp Range: -40 to 125 degC; Mounting Technology: Surface Mount; Code_JEDEC: MS-012-AA; PartNumber: ADR421ARZ; ComponentLink1Description: Manufacturer URL; ComponentLink1URL: http://www.analog.com/en/index.html; ComponentLink2Description: Datasheet; ComponentLink2URL: http://www.analog.com/static/imported-files/data_sheets/ADR420_421_423_425.pdf; ComponentLink3Description: Package Specification; ComponentLink3URL: http://www.analog.com/static/imported-files/packages/PKG_PDF/SOIC_Narrow%20(R)/R_8.pdf; ComponentLink4Description: URL Link1; ComponentLink4URL: Product URL:http://www.analog.com/en/special-linear-functions/voltage-references/adr421/products/product.html

## Sheet DAQ_Header.SchDoc
size OrCAD A
Used 8 times, as channels DAQ1, DAQ2, DAQ3, DAQ4, DAQ5, DAQ6, DAQ7, DAQ8. Parts and nets are listed once, with the designators drawn on the sheet.
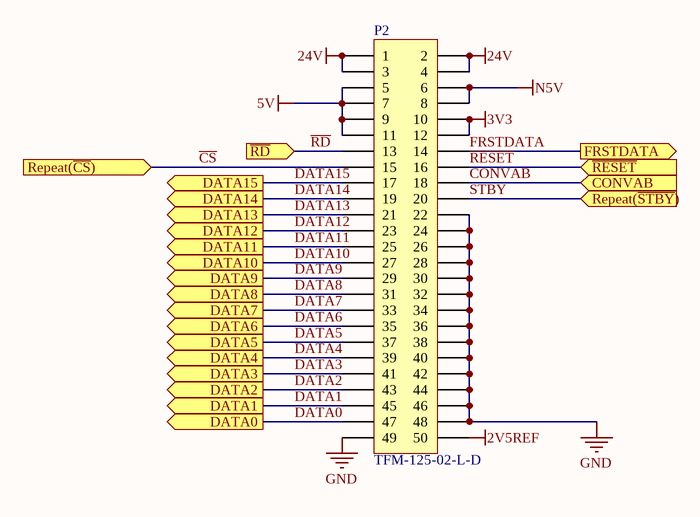
[diagram p3: DAQ_Header.SchDoc]

### Parts
P2  TFM-125-02-L-D  [TFM-125-02-X-D]

### Ports
CONVAB (in), DATA0 (out), DATA1 (out), DATA2 (out), DATA3 (out), DATA4 (out), DATA5 (out), DATA6 (out), DATA7 (out), DATA8 (out), DATA9 (out), DATA10 (out), DATA11 (out), DATA12 (out), DATA13 (out), DATA14 (out), DATA15 (out), FRSTDATA (out), Repeat(~{CS}) (in), Repeat(~{STBY}) (in), ~{RD} (in), ~{RESET} (in)

### Nets
2V5REF: P2.50
3V3: P2.10 P2.12
5V: P2.5 P2.7 P2.9 P2.11
24V: P2.1 P2.2 P2.3 P2.4
GND: P2.22 P2.24 P2.26 P2.28 P2.30 P2.32 P2.34 P2.36 P2.38 P2.40 P2.42 P2.44 P2.46 P2.48 P2.49
N5V: P2.6 P2.8
~{CS}: P2.15 ; port Repeat(~{CS})
CONVAB: P2.18 ; port CONVAB
DATA0: P2.47 ; port DATA0
DATA1: P2.45 ; port DATA1
DATA2: P2.43 ; port DATA2
DATA3: P2.41 ; port DATA3
DATA4: P2.39 ; port DATA4
DATA5: P2.37 ; port DATA5
DATA6: P2.35 ; port DATA6
DATA7: P2.33 ; port DATA7
DATA8: P2.31 ; port DATA8
DATA9: P2.29 ; port DATA9
DATA10: P2.27 ; port DATA10
DATA11: P2.25 ; port DATA11
DATA12: P2.23 ; port DATA12
DATA13: P2.21 ; port DATA13
DATA14: P2.19 ; port DATA14
DATA15: P2.17 ; port DATA15
FRSTDATA: P2.14 ; port FRSTDATA
~{RD}: P2.13 ; port ~{RD}
~{RESET}: P2.16 ; port ~{RESET}
~{STBY}: P2.20 ; port Repeat(~{STBY})

### Channels
DAQ1: designators end in _DAQ1; ports CONVAB=CONVAB DATA0=DATA0 DATA1=DATA1 DATA2=DATA2 DATA3=DATA3 DATA4=DATA4 DATA5=DATA5 DATA6=DATA6 DATA7=DATA7 DATA8=DATA8 DATA9=DATA9 DATA10=DATA10 DATA11=DATA11 DATA12=DATA12 DATA13=DATA13 DATA14=DATA14 DATA15=DATA15 FRSTDATA=FRSTDATA Repeat(~{CS})=~{CS}_DAQ1 Repeat(~{STBY})=~{STBY}_DAQ1 ~{RD}=~{RD} ~{RESET}=~{RESET}
DAQ2: designators end in _DAQ2; ports CONVAB=CONVAB DATA0=DATA0 DATA1=DATA1 DATA2=DATA2 DATA3=DATA3 DATA4=DATA4 DATA5=DATA5 DATA6=DATA6 DATA7=DATA7 DATA8=DATA8 DATA9=DATA9 DATA10=DATA10 DATA11=DATA11 DATA12=DATA12 DATA13=DATA13 DATA14=DATA14 DATA15=DATA15 FRSTDATA=FRSTDATA Repeat(~{CS})=~{CS}_DAQ2 Repeat(~{STBY})=~{STBY}_DAQ2 ~{RD}=~{RD} ~{RESET}=~{RESET}
DAQ3: designators end in _DAQ3; ports CONVAB=CONVAB DATA0=DATA0 DATA1=DATA1 DATA2=DATA2 DATA3=DATA3 DATA4=DATA4 DATA5=DATA5 DATA6=DATA6 DATA7=DATA7 DATA8=DATA8 DATA9=DATA9 DATA10=DATA10 DATA11=DATA11 DATA12=DATA12 DATA13=DATA13 DATA14=DATA14 DATA15=DATA15 FRSTDATA=FRSTDATA Repeat(~{CS})=~{CS}_DAQ3 Repeat(~{STBY})=~{STBY}_DAQ3 ~{RD}=~{RD} ~{RESET}=~{RESET}
DAQ4: designators end in _DAQ4; ports CONVAB=CONVAB DATA0=DATA0 DATA1=DATA1 DATA2=DATA2 DATA3=DATA3 DATA4=DATA4 DATA5=DATA5 DATA6=DATA6 DATA7=DATA7 DATA8=DATA8 DATA9=DATA9 DATA10=DATA10 DATA11=DATA11 DATA12=DATA12 DATA13=DATA13 DATA14=DATA14 DATA15=DATA15 FRSTDATA=FRSTDATA Repeat(~{CS})=~{CS}_DAQ4 Repeat(~{STBY})=~{STBY}_DAQ4 ~{RD}=~{RD} ~{RESET}=~{RESET}
DAQ5: designators end in _DAQ5; ports CONVAB=CONVAB DATA0=DATA0 DATA1=DATA1 DATA2=DATA2 DATA3=DATA3 DATA4=DATA4 DATA5=DATA5 DATA6=DATA6 DATA7=DATA7 DATA8=DATA8 DATA9=DATA9 DATA10=DATA10 DATA11=DATA11 DATA12=DATA12 DATA13=DATA13 DATA14=DATA14 DATA15=DATA15 FRSTDATA=FRSTDATA Repeat(~{CS})=~{CS}_DAQ5 Repeat(~{STBY})=~{STBY}_DAQ5 ~{RD}=~{RD} ~{RESET}=~{RESET}
DAQ6: designators end in _DAQ6; ports CONVAB=CONVAB DATA0=DATA0 DATA1=DATA1 DATA2=DATA2 DATA3=DATA3 DATA4=DATA4 DATA5=DATA5 DATA6=DATA6 DATA7=DATA7 DATA8=DATA8 DATA9=DATA9 DATA10=DATA10 DATA11=DATA11 DATA12=DATA12 DATA13=DATA13 DATA14=DATA14 DATA15=DATA15 FRSTDATA=FRSTDATA Repeat(~{CS})=~{CS}_DAQ6 Repeat(~{STBY})=~{STBY}_DAQ6 ~{RD}=~{RD} ~{RESET}=~{RESET}
DAQ7: designators end in _DAQ7; ports CONVAB=CONVAB DATA0=DATA0 DATA1=DATA1 DATA2=DATA2 DATA3=DATA3 DATA4=DATA4 DATA5=DATA5 DATA6=DATA6 DATA7=DATA7 DATA8=DATA8 DATA9=DATA9 DATA10=DATA10 DATA11=DATA11 DATA12=DATA12 DATA13=DATA13 DATA14=DATA14 DATA15=DATA15 FRSTDATA=FRSTDATA Repeat(~{CS})=~{CS}_DAQ7 Repeat(~{STBY})=~{STBY}_DAQ7 ~{RD}=~{RD} ~{RESET}=~{RESET}
DAQ8: designators end in _DAQ8; ports CONVAB=CONVAB DATA0=DATA0 DATA1=DATA1 DATA2=DATA2 DATA3=DATA3 DATA4=DATA4 DATA5=DATA5 DATA6=DATA6 DATA7=DATA7 DATA8=DATA8 DATA9=DATA9 DATA10=DATA10 DATA11=DATA11 DATA12=DATA12 DATA13=DATA13 DATA14=DATA14 DATA15=DATA15 FRSTDATA=FRSTDATA Repeat(~{CS})=~{CS}_DAQ8 Repeat(~{STBY})=~{STBY}_DAQ8 ~{RD}=~{RD} ~{RESET}=~{RESET}

### Library data of the parts
P2 = Header 25X2: Header, 25-Pin, Dual row; LatestRevisionDate: 17-Jul-2002; LatestRevisionNote: Re-released for DXP Platform.; Publisher: Altium Limited; Supplier Part Number 1: TFM-125-02-L-D; Supplier 1: Samtec

## Nets that join several sheets
2V5REF: Power_Reg (U5.6), DAQ1 (P2_DAQ1.50), DAQ2 (P2_DAQ2.50), DAQ3 (P2_DAQ3.50), DAQ4 (P2_DAQ4.50), DAQ5 (P2_DAQ5.50), DAQ6 (P2_DAQ6.50), DAQ7 (P2_DAQ7.50), DAQ8 (P2_DAQ8.50)
3V3: uC_Board (28 pins), Power_Reg (R12.2), DAQ1 (P2_DAQ1.10 P2_DAQ1.12), DAQ2 (P2_DAQ2.10 P2_DAQ2.12), DAQ3 (P2_DAQ3.10 P2_DAQ3.12), DAQ4 (P2_DAQ4.10 P2_DAQ4.12), DAQ5 (P2_DAQ5.10 P2_DAQ5.12), DAQ6 (P2_DAQ6.10 P2_DAQ6.12), DAQ7 (P2_DAQ7.10 P2_DAQ7.12), DAQ8 (P2_DAQ8.10 P2_DAQ8.12)
5V: Power_Reg (5 pins), DAQ1 (P2_DAQ1.5 P2_DAQ1.7 P2_DAQ1.9 P2_DAQ1.11), DAQ2 (P2_DAQ2.5 P2_DAQ2.7 P2_DAQ2.9 P2_DAQ2.11), DAQ3 (P2_DAQ3.5 P2_DAQ3.7 P2_DAQ3.9 P2_DAQ3.11), DAQ4 (P2_DAQ4.5 P2_DAQ4.7 P2_DAQ4.9 P2_DAQ4.11), DAQ5 (P2_DAQ5.5 P2_DAQ5.7 P2_DAQ5.9 P2_DAQ5.11), DAQ6 (P2_DAQ6.5 P2_DAQ6.7 P2_DAQ6.9 P2_DAQ6.11), DAQ7 (P2_DAQ7.5 P2_DAQ7.7 P2_DAQ7.9 P2_DAQ7.11), DAQ8 (P2_DAQ8.5 P2_DAQ8.7 P2_DAQ8.9 P2_DAQ8.11)
24V: Power_Reg (5 pins), DAQ1 (P2_DAQ1.1 P2_DAQ1.2 P2_DAQ1.3 P2_DAQ1.4), DAQ2 (P2_DAQ2.1 P2_DAQ2.2 P2_DAQ2.3 P2_DAQ2.4), DAQ3 (P2_DAQ3.1 P2_DAQ3.2 P2_DAQ3.3 P2_DAQ3.4), DAQ4 (P2_DAQ4.1 P2_DAQ4.2 P2_DAQ4.3 P2_DAQ4.4), DAQ5 (P2_DAQ5.1 P2_DAQ5.2 P2_DAQ5.3 P2_DAQ5.4), DAQ6 (P2_DAQ6.1 P2_DAQ6.2 P2_DAQ6.3 P2_DAQ6.4), DAQ7 (P2_DAQ7.1 P2_DAQ7.2 P2_DAQ7.3 P2_DAQ7.4), DAQ8 (P2_DAQ8.1 P2_DAQ8.2 P2_DAQ8.3 P2_DAQ8.4)
GND: uC_Board (42 pins), Power_Reg (20 pins), DAQ1 (15 pins), DAQ2 (15 pins), DAQ3 (15 pins), DAQ4 (15 pins), DAQ5 (15 pins), DAQ6 (15 pins), DAQ7 (15 pins), DAQ8 (15 pins)
N5V: Power_Reg (R10.2), DAQ1 (P2_DAQ1.6 P2_DAQ1.8), DAQ2 (P2_DAQ2.6 P2_DAQ2.8), DAQ3 (P2_DAQ3.6 P2_DAQ3.8), DAQ4 (P2_DAQ4.6 P2_DAQ4.8), DAQ5 (P2_DAQ5.6 P2_DAQ5.8), DAQ6 (P2_DAQ6.6 P2_DAQ6.8), DAQ7 (P2_DAQ7.6 P2_DAQ7.8), DAQ8 (P2_DAQ8.6 P2_DAQ8.8)
CONVAB: uC_Board (U1.49), DAQ1 (P2_DAQ1.18), DAQ2 (P2_DAQ2.18), DAQ3 (P2_DAQ3.18), DAQ4 (P2_DAQ4.18), DAQ5 (P2_DAQ5.18), DAQ6 (P2_DAQ6.18), DAQ7 (P2_DAQ7.18), DAQ8 (P2_DAQ8.18)
DATA0: uC_Board (U1.114), DAQ1 (P2_DAQ1.47), DAQ2 (P2_DAQ2.47), DAQ3 (P2_DAQ3.47), DAQ4 (P2_DAQ4.47), DAQ5 (P2_DAQ5.47), DAQ6 (P2_DAQ6.47), DAQ7 (P2_DAQ7.47), DAQ8 (P2_DAQ8.47)
DATA1: uC_Board (U1.115), DAQ1 (P2_DAQ1.45), DAQ2 (P2_DAQ2.45), DAQ3 (P2_DAQ3.45), DAQ4 (P2_DAQ4.45), DAQ5 (P2_DAQ5.45), DAQ6 (P2_DAQ6.45), DAQ7 (P2_DAQ7.45), DAQ8 (P2_DAQ8.45)
DATA2: uC_Board (U1.116), DAQ1 (P2_DAQ1.43), DAQ2 (P2_DAQ2.43), DAQ3 (P2_DAQ3.43), DAQ4 (P2_DAQ4.43), DAQ5 (P2_DAQ5.43), DAQ6 (P2_DAQ6.43), DAQ7 (P2_DAQ7.43), DAQ8 (P2_DAQ8.43)
DATA3: uC_Board (U1.117), DAQ1 (P2_DAQ1.41), DAQ2 (P2_DAQ2.41), DAQ3 (P2_DAQ3.41), DAQ4 (P2_DAQ4.41), DAQ5 (P2_DAQ5.41), DAQ6 (P2_DAQ6.41), DAQ7 (P2_DAQ7.41), DAQ8 (P2_DAQ8.41)
DATA4: uC_Board (U1.131), DAQ1 (P2_DAQ1.39), DAQ2 (P2_DAQ2.39), DAQ3 (P2_DAQ3.39), DAQ4 (P2_DAQ4.39), DAQ5 (P2_DAQ5.39), DAQ6 (P2_DAQ6.39), DAQ7 (P2_DAQ7.39), DAQ8 (P2_DAQ8.39)
DATA5: uC_Board (U1.132), DAQ1 (P2_DAQ1.37), DAQ2 (P2_DAQ2.37), DAQ3 (P2_DAQ3.37), DAQ4 (P2_DAQ4.37), DAQ5 (P2_DAQ5.37), DAQ6 (P2_DAQ6.37), DAQ7 (P2_DAQ7.37), DAQ8 (P2_DAQ8.37)
DATA6: uC_Board (U1.133), DAQ1 (P2_DAQ1.35), DAQ2 (P2_DAQ2.35), DAQ3 (P2_DAQ3.35), DAQ4 (P2_DAQ4.35), DAQ5 (P2_DAQ5.35), DAQ6 (P2_DAQ6.35), DAQ7 (P2_DAQ7.35), DAQ8 (P2_DAQ8.35)
DATA7: uC_Board (U1.134), DAQ1 (P2_DAQ1.33), DAQ2 (P2_DAQ2.33), DAQ3 (P2_DAQ3.33), DAQ4 (P2_DAQ4.33), DAQ5 (P2_DAQ5.33), DAQ6 (P2_DAQ6.33), DAQ7 (P2_DAQ7.33), DAQ8 (P2_DAQ8.33)
DATA8: uC_Board (U1.7), DAQ1 (P2_DAQ1.31), DAQ2 (P2_DAQ2.31), DAQ3 (P2_DAQ3.31), DAQ4 (P2_DAQ4.31), DAQ5 (P2_DAQ5.31), DAQ6 (P2_DAQ6.31), DAQ7 (P2_DAQ7.31), DAQ8 (P2_DAQ8.31)
DATA9: uC_Board (U1.8), DAQ1 (P2_DAQ1.29), DAQ2 (P2_DAQ2.29), DAQ3 (P2_DAQ3.29), DAQ4 (P2_DAQ4.29), DAQ5 (P2_DAQ5.29), DAQ6 (P2_DAQ6.29), DAQ7 (P2_DAQ7.29), DAQ8 (P2_DAQ8.29)
DATA10: uC_Board (U1.10), DAQ1 (P2_DAQ1.27), DAQ2 (P2_DAQ2.27), DAQ3 (P2_DAQ3.27), DAQ4 (P2_DAQ4.27), DAQ5 (P2_DAQ5.27), DAQ6 (P2_DAQ6.27), DAQ7 (P2_DAQ7.27), DAQ8 (P2_DAQ8.27)
DATA11: uC_Board (U1.27), DAQ1 (P2_DAQ1.25), DAQ2 (P2_DAQ2.25), DAQ3 (P2_DAQ3.25), DAQ4 (P2_DAQ4.25), DAQ5 (P2_DAQ5.25), DAQ6 (P2_DAQ6.25), DAQ7 (P2_DAQ7.25), DAQ8 (P2_DAQ8.25)
DATA12: uC_Board (U1.9), DAQ1 (P2_DAQ1.23), DAQ2 (P2_DAQ2.23), DAQ3 (P2_DAQ3.23), DAQ4 (P2_DAQ4.23), DAQ5 (P2_DAQ5.23), DAQ6 (P2_DAQ6.23), DAQ7 (P2_DAQ7.23), DAQ8 (P2_DAQ8.23)
DATA13: uC_Board (U1.28), DAQ1 (P2_DAQ1.21), DAQ2 (P2_DAQ2.21), DAQ3 (P2_DAQ3.21), DAQ4 (P2_DAQ4.21), DAQ5 (P2_DAQ5.21), DAQ6 (P2_DAQ6.21), DAQ7 (P2_DAQ7.21), DAQ8 (P2_DAQ8.21)
DATA14: uC_Board (U1.29), DAQ1 (P2_DAQ1.19), DAQ2 (P2_DAQ2.19), DAQ3 (P2_DAQ3.19), DAQ4 (P2_DAQ4.19), DAQ5 (P2_DAQ5.19), DAQ6 (P2_DAQ6.19), DAQ7 (P2_DAQ7.19), DAQ8 (P2_DAQ8.19)
DATA15: uC_Board (U1.30), DAQ1 (P2_DAQ1.17), DAQ2 (P2_DAQ2.17), DAQ3 (P2_DAQ3.17), DAQ4 (P2_DAQ4.17), DAQ5 (P2_DAQ5.17), DAQ6 (P2_DAQ6.17), DAQ7 (P2_DAQ7.17), DAQ8 (P2_DAQ8.17)
FRSTDATA: uC_Board (U1.47), DAQ1 (P2_DAQ1.14), DAQ2 (P2_DAQ2.14), DAQ3 (P2_DAQ3.14), DAQ4 (P2_DAQ4.14), DAQ5 (P2_DAQ5.14), DAQ6 (P2_DAQ6.14), DAQ7 (P2_DAQ7.14), DAQ8 (P2_DAQ8.14)
~{RD}: uC_Board (U1.50), DAQ1 (P2_DAQ1.13), DAQ2 (P2_DAQ2.13), DAQ3 (P2_DAQ3.13), DAQ4 (P2_DAQ4.13), DAQ5 (P2_DAQ5.13), DAQ6 (P2_DAQ6.13), DAQ7 (P2_DAQ7.13), DAQ8 (P2_DAQ8.13)
~{RESET}: uC_Board (U1.48), DAQ1 (P2_DAQ1.16), DAQ2 (P2_DAQ2.16), DAQ3 (P2_DAQ3.16), DAQ4 (P2_DAQ4.16), DAQ5 (P2_DAQ5.16), DAQ6 (P2_DAQ6.16), DAQ7 (P2_DAQ7.16), DAQ8 (P2_DAQ8.16)